# Altium schematic sheet [2]-Power Budget.SchDoc
size A4; DocumentNumber: 2; SheetNumber: 2; SheetTotal: 11
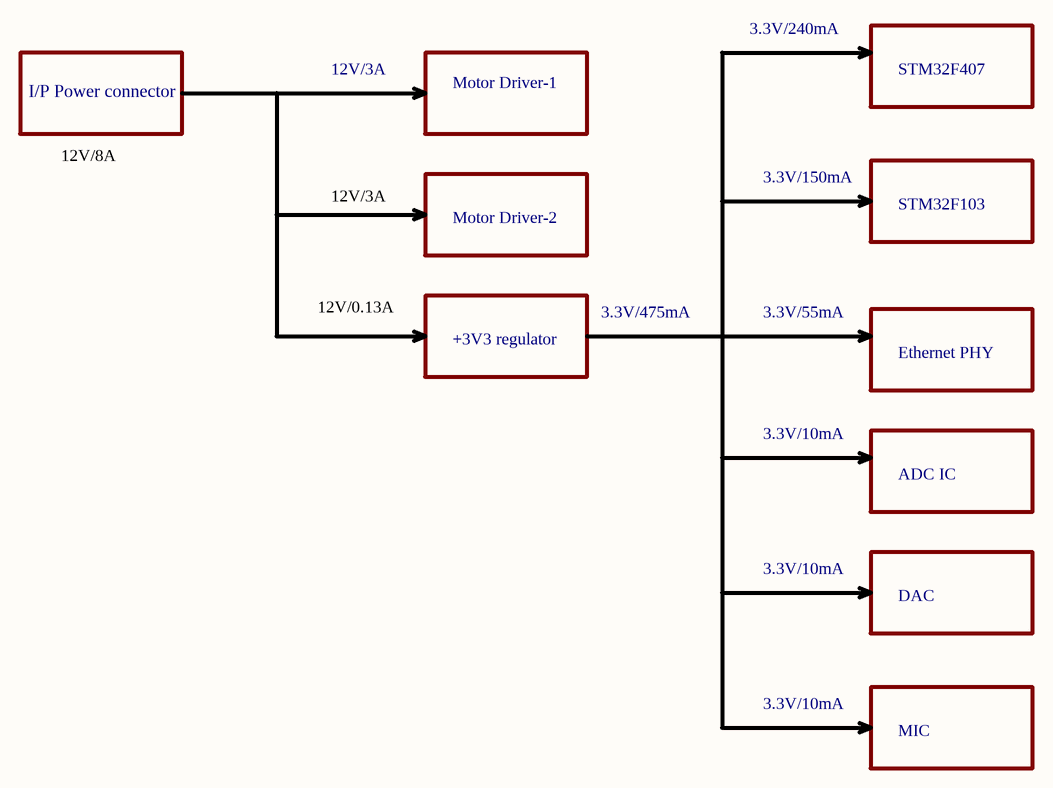
[diagram p0: [2]-Power Budget.SchDoc]

## Notes on the sheet
- 12V/3A
- 3.3V/240mA
- STM32F407
- I/P Power connector
- Motor Driver-1
- 12V/8A
- 3.3V/150mA
- STM32F103
- Motor Driver-2
- 12V/0.13A
- +3V3 regulator
- 3.3V/475mA
- 3.3V/55mA
- Ethernet PHY
- 3.3V/10mA
- ADC IC
- DAC
- MIC